# EAGLE schematic slave-relay-v1 (EAGLE 6.5.0)
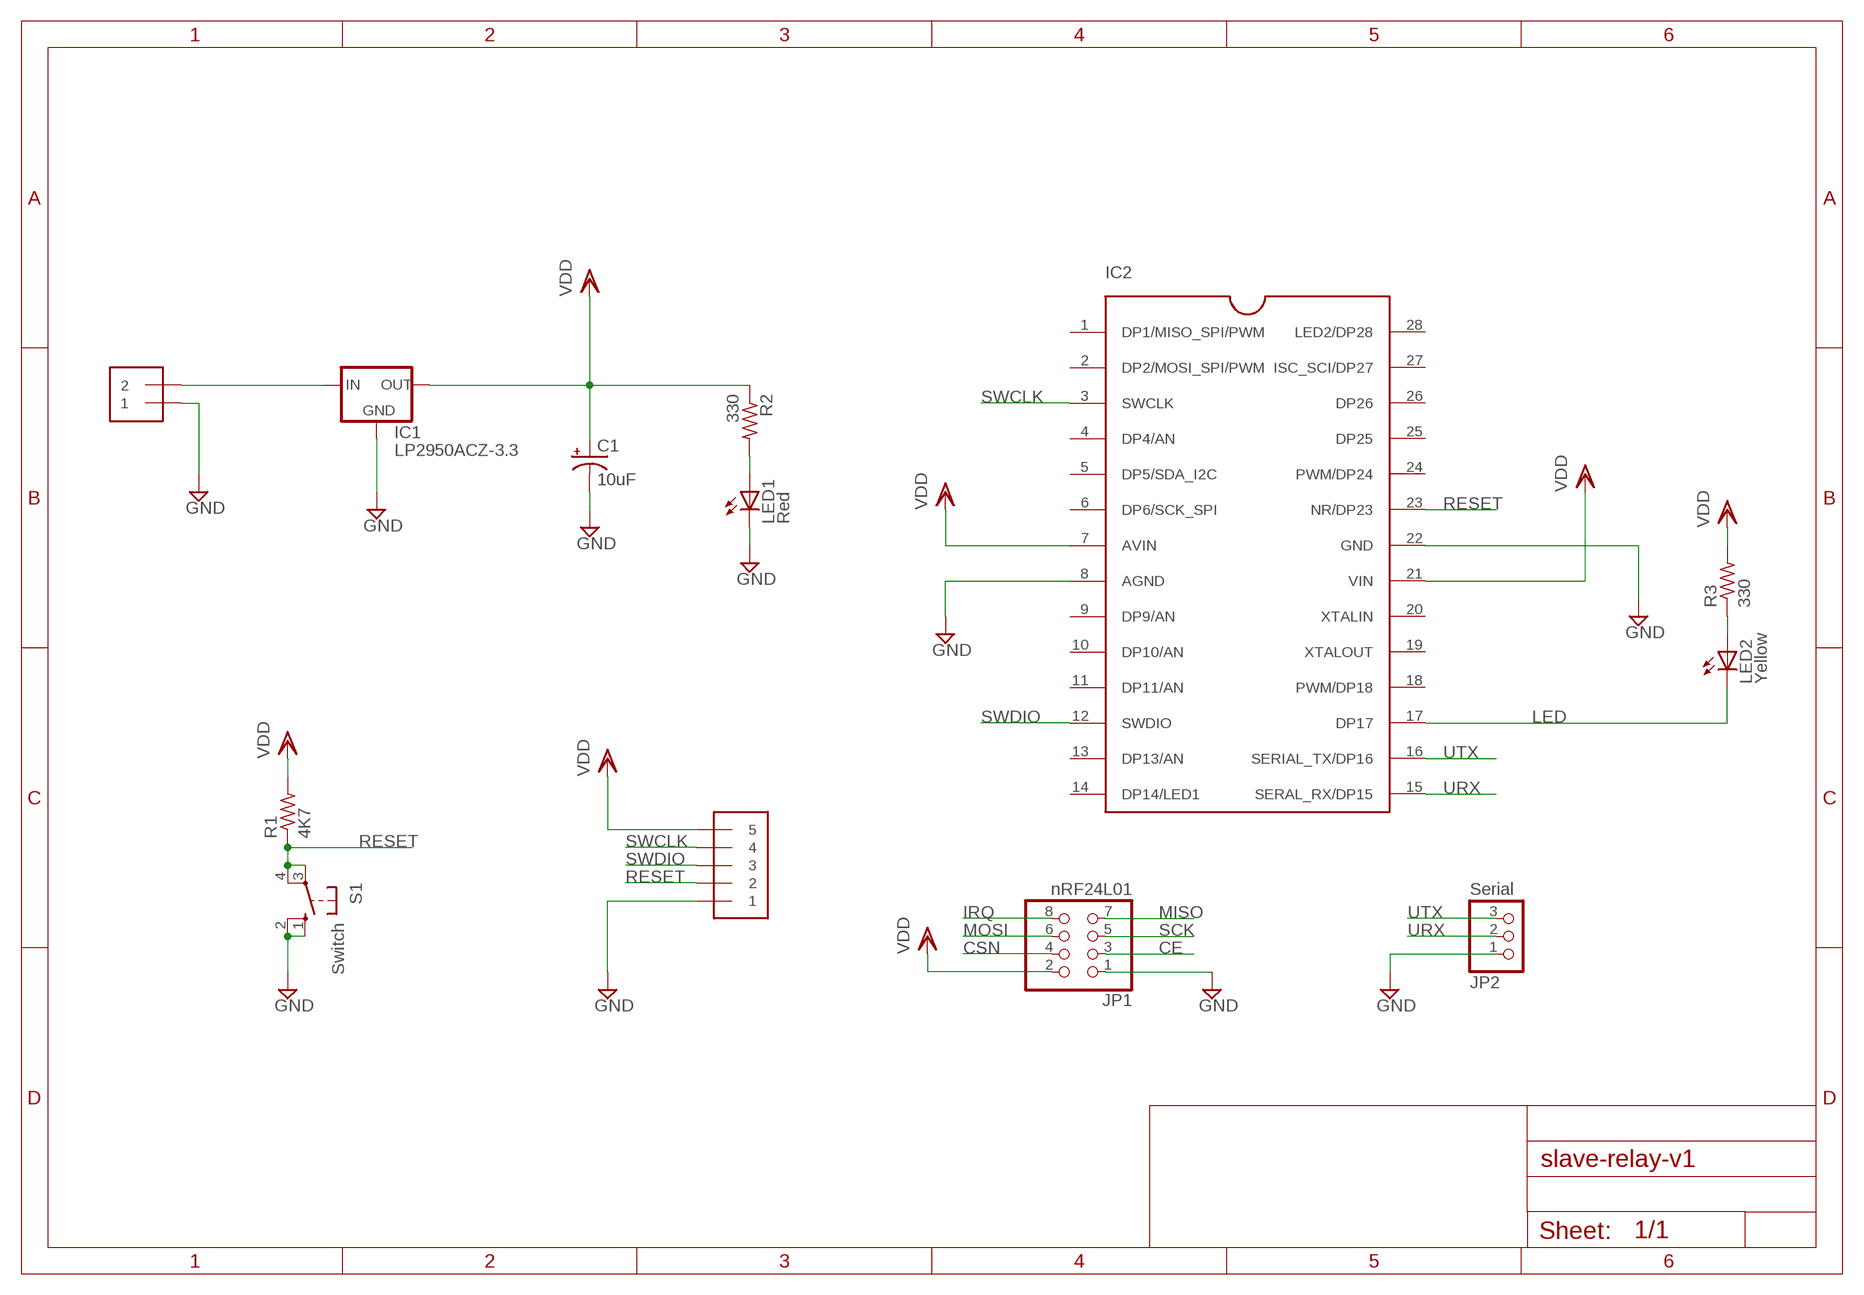
[diagram p0: schematic, sheet 1]

## Parts
C1  10uF  CPOL-USE2.5-7  [E2,5-7]
IC1  LP2950ACZ-3.3  [TO92]
IC2  LPC1114FN28  [DIP28]
J1  1X2-3.5MM  [1X2-3.5MM]
J2  SWD Debug  1X5  [1X05-3.5MM]
JP1  nRF24L01  PINHD-2X4  [2X04]
JP2  Serial  PINHD-1X3  [1X03]
LED1  Red  LED5MM  [LED5MM]
LED2  Yellow  LED5MM  [LED5MM]
R1  4K7  FLIPFLOP-RES  [0805-THM]
R2  330  FLIPFLOP-RES  [0805-THM]
R3  330  FLIPFLOP-RES  [0805-THM]
S1  Switch  40-XX  [B3F-40XX]

## Nets
CE: JP1.3
CSN: JP1.4
GND: C1.- IC1.2(GND) IC2.8(AGND) IC2.22(GND) J1.1 J2.1 JP1.1 JP2.1 LED1.K(C) S1.1(S) S1.2(S1)
IRQ: JP1.8
LED: IC2.17(DP17) LED2.K(C)
MISO: JP1.7
MOSI: JP1.6
N$1: IC1.3(IN) J1.2
N$4: LED1.A R2.2
N$6: LED2.A R3.1
RESET: IC2.23(NR/DP23) J2.2 R1.1 S1.3(P) S1.4(P1)
SCK: JP1.5
SWCLK: IC2.3(SWCLK) J2.4
SWDIO: IC2.12(SWDIO) J2.3
URX: IC2.15(SERAL_RX/DP15) JP2.2
UTX: IC2.16(SERIAL_TX/DP16) JP2.3
VDD: C1.+ IC1.1(OUT) IC2.7(AVIN) IC2.21(VIN) J2.5 JP1.2 R1.2 R2.1 R3.2
Unconnected: IC2.1(DP1/MISO_SPI/PWM) IC2.2(DP2/MOSI_SPI/PWM) IC2.4(DP4/AN) IC2.5(DP5/SDA_I2C) IC2.6(DP6/SCK_SPI) IC2.9(DP9/AN) IC2.10(DP10/AN) IC2.11(DP11/AN) IC2.13(DP13/AN) IC2.14(DP14/LED1) IC2.18(PWM/DP18) IC2.19(XTALOUT) IC2.20(XTALIN) IC2.24(PWM/DP24) IC2.25(DP25) IC2.26(DP26) IC2.27(ISC_SCI/DP27) IC2.28(LED2/DP28)

## Library data of the parts
C1 = adafruit:CPOL-US: POLARIZED CAPACITOR, American symbol
IC1 = v-reg:LP2950?*: Source: http://cache.national.com/ds/LP/LP2950.pdf; OC_FARNELL: unknown
IC2 = lpc1114fn28:LPC1114FN28; OC_FARNELL: unknown
J1 = adafruit:1X2: 3.5mm Terminal block http://www.ladyada.net/library/pcb/eaglelibrary.html
J2 = adafruit:1X5
JP1 = adafruit:PINHD-2X4: PIN HEADER
JP2 = adafruit:PINHD-1X3: PIN HEADER
LED1 = adafruit:LED: LED OSRAM: - CHIPLED LG R971, LG N971, LY N971, LG Q971, LY Q971, LO R971, LY R971 LH N974, LH R974 LS Q976, LO Q976, LY Q976 LO Q996 - Hyper CHIPLED LW Q18S LB Q993, LB Q99A, LB R99A - SideLED LS A670, LO A670, LY A670, LG A670, LP A670 LB A673, LV A673, LT A673, LW A673 LH A674 LY A675 LS A676, LA A676, LO A676, LY A676, LW A676 LS A679, LY A679, LG A679 - Hyper Micro SIDELED® LS Y876, LA Y876, LO Y876, LY Y876 LT Y87S - SmartLED LW L88C, LW L88S LB L89C, LB L89S, LG L890 LS L89K, LO L89K, LY L89K LS L896, LA L896, LO L896, LY L896 - TOPLED LS T670, LO T670, LY T670, LG T670, LP T670 LSG T670, LSP T670, LSY T670, LOP T670, LYG T670 LG T671, LOG T671, LSG T671 LB T673, LV T673, LT T673, LW T673 LH T674 LS T676, LA T676, LO T676, LY T676, LB T676, LH T676, LSB T676, LW T676 LB T67C, LV T67C, LT T67C, LS T67K, LO T67K, LY T67K, LW E67C LS E67B, LA E67B, LO E67B, LY E67B, LB E67C, LV E67C, LT E67C LW T67C LS T679, LY T679, LG T679 LS T770, LO T770, LY T770, LG T770, LP T770 LB T773, LV T773, LT T773, LW T773 LH T774 LS E675, LA E675, LY E675, LS T675 LS T776, LA T776, LO T776, LY T776, LB T776 LHGB T686 LT T68C, LB T68C - Hyper Mini TOPLED® LB M676 - Mini TOPLED Santana® LG M470 LS M47K, LO M47K, LY M47K Source: http://www.osram.convergy.de/
LED2 = adafruit:LED: LED OSRAM: - CHIPLED LG R971, LG N971, LY N971, LG Q971, LY Q971, LO R971, LY R971 LH N974, LH R974 LS Q976, LO Q976, LY Q976 LO Q996 - Hyper CHIPLED LW Q18S LB Q993, LB Q99A, LB R99A - SideLED LS A670, LO A670, LY A670, LG A670, LP A670 LB A673, LV A673, LT A673, LW A673 LH A674 LY A675 LS A676, LA A676, LO A676, LY A676, LW A676 LS A679, LY A679, LG A679 - Hyper Micro SIDELED® LS Y876, LA Y876, LO Y876, LY Y876 LT Y87S - SmartLED LW L88C, LW L88S LB L89C, LB L89S, LG L890 LS L89K, LO L89K, LY L89K LS L896, LA L896, LO L896, LY L896 - TOPLED LS T670, LO T670, LY T670, LG T670, LP T670 LSG T670, LSP T670, LSY T670, LOP T670, LYG T670 LG T671, LOG T671, LSG T671 LB T673, LV T673, LT T673, LW T673 LH T674 LS T676, LA T676, LO T676, LY T676, LB T676, LH T676, LSB T676, LW T676 LB T67C, LV T67C, LT T67C, LS T67K, LO T67K, LY T67K, LW E67C LS E67B, LA E67B, LO E67B, LY E67B, LB E67C, LV E67C, LT E67C LW T67C LS T679, LY T679, LG T679 LS T770, LO T770, LY T770, LG T770, LP T770 LB T773, LV T773, LT T773, LW T773 LH T774 LS E675, LA E675, LY E675, LS T675 LS T776, LA T776, LO T776, LY T776, LB T776 LHGB T686 LT T68C, LB T68C - Hyper Mini TOPLED® LB M676 - Mini TOPLED Santana® LG M470 LS M47K, LO M47K, LY M47K Source: http://www.osram.convergy.de/; OC_FARNELL: unknown
R1-R3 = adafruit:FLIPFLOP-RES: Flip Flop resistor An 0805 resistor inside a standard 1/4W 5% resistor. Makes for easy mods; OC_FARNELL: unknown
S1 = adafruit:40-XX: OMRON SWITCH; MF: OMRON COMPONENTS USA; MPN: B3F-4000; OC_FARNELL: 176434; OC_NEWARK: 36K3105